# EAGLE design MakePython Lora V1.1 (EAGLE 6.1)
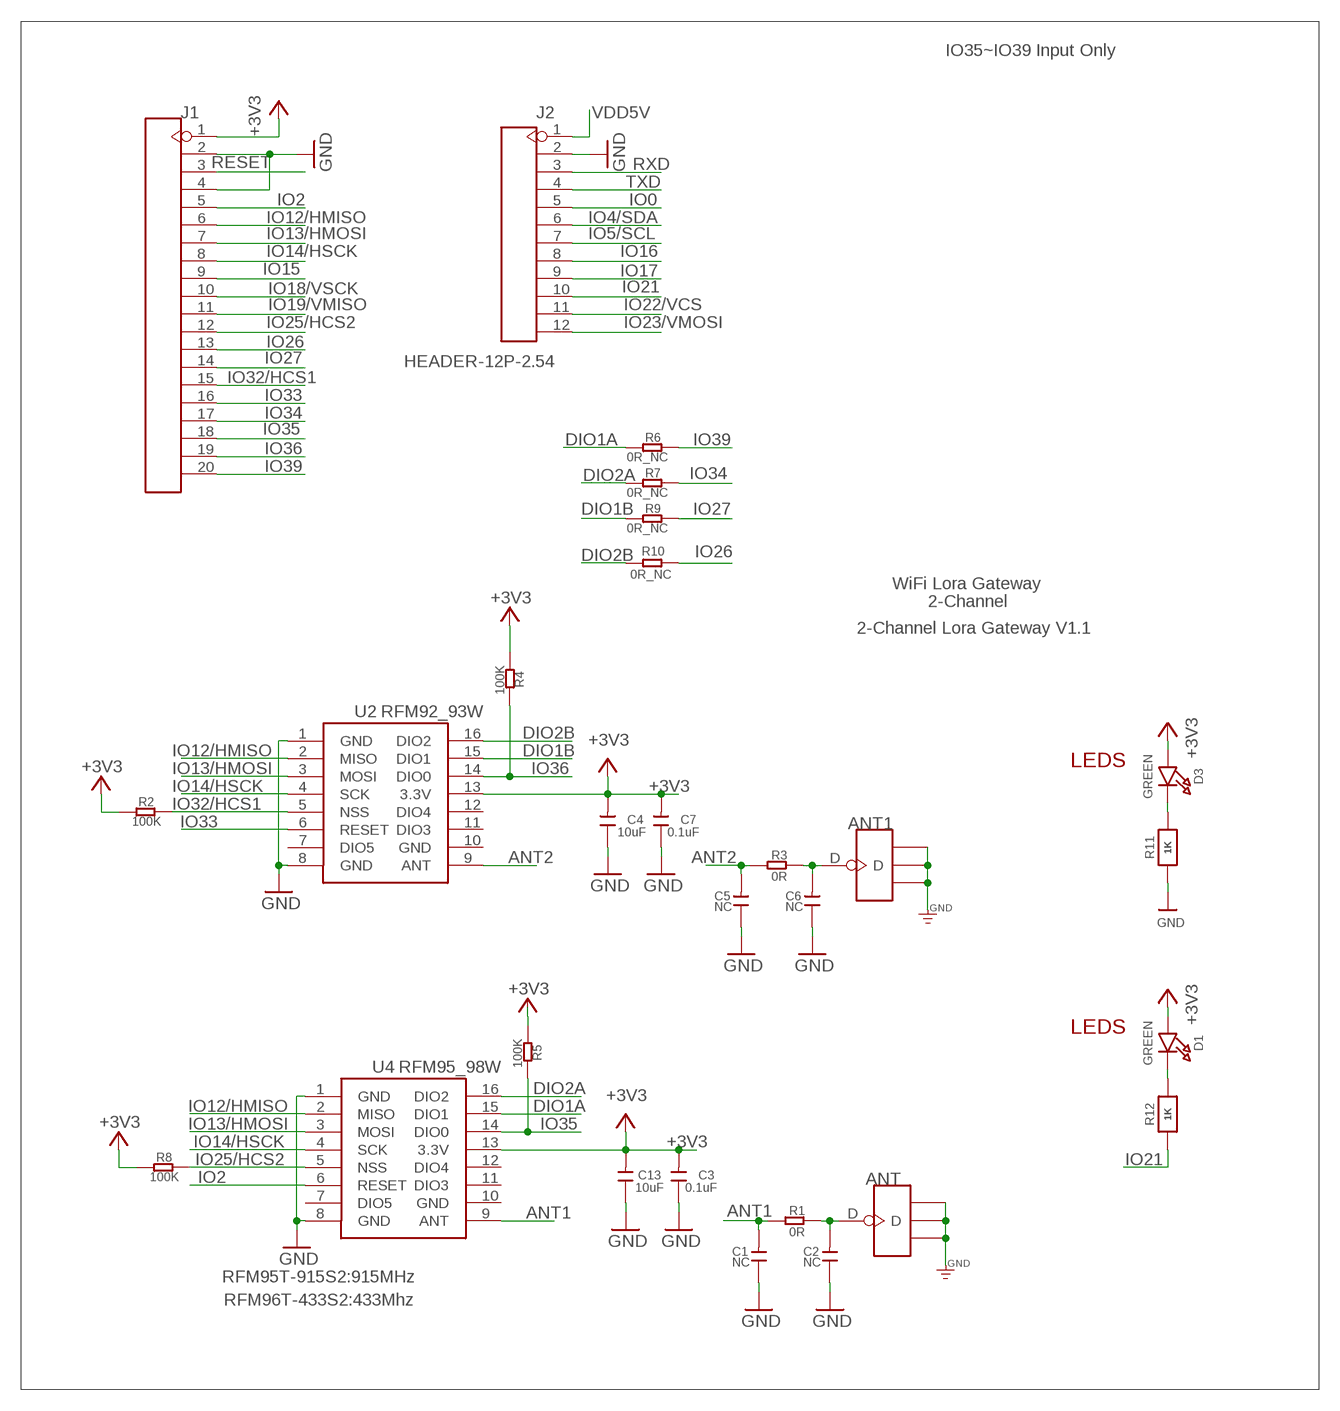
[diagram p0: schematic, sheet 1]

## Parts
ANT  ANTENNA-U-FL  [4P-U-FL]
ANT1  ANTENNA-U-FL  [4P-U-FL]
C1  NC  DISCRETE_C-0603  [DISCRETE_C0603]
C2  NC  DISCRETE_C-0603  [DISCRETE_C0603]
C3  0.1uF  C-0603  [0603]
C4  10uF  C-0603  [0603]
C5  NC  DISCRETE_C-0603  [DISCRETE_C0603]
C6  NC  DISCRETE_C-0603  [DISCRETE_C0603]
C7  0.1uF  C-0603  [0603]
C13  10uF  C-0603  [0603]
D1  GREEN  LED0805_NOOUTLINE  [CHIPLED_0805_NOOUTLINE]
D3  GREEN  LED0805_NOOUTLINE  [CHIPLED_0805_NOOUTLINE]
J1  HEADER-20P-2.54  [20P-2.54]
J2  HEADER-12P-2.54  [12P-2.54]
R1  0R  DISCRETE_R-0603  [DISCRETE_R0603]
R2  100K  R-0603  [R0603]
R3  0R  DISCRETE_R-0603  [DISCRETE_R0603]
R4  100K  R-0603  [R0603]
R5  100K  R-0603  [R0603]
R6  0R_NC  R-0603  [R0603]
R7  0R_NC  R-0603  [R0603]
R8  100K  R-0603  [R0603]
R9  0R_NC  R-0603  [R0603]
R10  0R_NC  R-0603  [R0603]
R11  1K  RESISTOR_0603_NOOUT  [0603-NO]
R12  1K  RESISTOR_0603_NOOUT  [0603-NO]
U2  RFM92_93W  [RFM92_93W]
U4  RFM95_98W  RFM92_93W  [RFM92_93W]

## Nets
+3V3: C3.2 C4.2 C7.2 C13.2 D1.A D3.A J1.1 R2.2 R4.2 R5.2 R8.2 U2.13(3.3V) U4.13(3.3V)
ANT1: C1.2 R1.1 U4.9(ANT)
ANT2: C5.2 R3.1 U2.9(ANT)
DIO1A: R6.2 U4.15(DIO1)
DIO1B: R9.2 U2.15(DIO1)
DIO2A: R7.2 U4.16(DIO2)
DIO2B: R10.2 U2.16(DIO2)
GND: ANT1.GND1 ANT1.GND2 ANT1.GND3 ANT.GND1 ANT.GND2 ANT.GND3 C1.1 C2.1 C3.1 C4.1 C5.1 C6.1 C7.1 C13.1 J1.2 J1.4 J2.2 R11.1 U2.1(GND) U2.8(GND) U4.1(GND) U4.8(GND)
IO0: J2.5
IO2: J1.5 U4.6(RESET)
IO4/SDA: J2.6
IO5/SCL: J2.7
IO12/HMISO: J1.6 U2.2(MISO) U4.2(MISO)
IO13/HMOSI: J1.7 U2.3(MOSI) U4.3(MOSI)
IO14/HSCK: J1.8 U2.4(SCK) U4.4(SCK)
IO15: J1.9
IO16: J2.8
IO17: J2.9
IO18/VSCK: J1.10
IO19/VMISO: J1.11
IO21: J2.10 R12.1
IO22/VCS: J2.11
IO23/VMOSI: J2.12
IO25/HCS2: J1.12 R8.1 U4.5(NSS)
IO26: J1.13 R10.1
IO27: J1.14 R9.1
IO32/HCS1: J1.15 R2.1 U2.5(NSS)
IO33: J1.16 U2.6(RESET)
IO34: J1.17 R7.1
IO35: J1.18 R5.1 U4.14(DIO0)
IO36: J1.19 R4.1 U2.14(DIO0)
IO39: J1.20 R6.1
N$1: ANT1.D C6.2 R3.2
N$2: ANT.D C2.2 R1.2
N$3: D1.C R12.2
N$5: D3.C R11.2
RESET: J1.3
RXD: J2.3
TXD: J2.4
VDD5V: J2.1
Unconnected: U2.7(DIO5) U2.11(DIO3) U2.12(DIO4) U4.7(DIO5) U4.11(DIO3) U4.12(DIO4)

## Notes on the sheet
- IO35~IO39 Input Only
- WiFi Lora Gateway
- 2-Channel
- 2-Channel Lora Gateway V1.1
- LEDS
- LEDS
- RFM95T-915S2:915MHz
- RFM96T-433S2:433Mhz

## Power pins joined to a net without a drawn wire
GND: U2.10(GND) U4.10(GND)

## Library data of the parts
ANT ANT1 = Connector:ANTENNA-U-FL
C1 C2 C5 C6 = A9G:DISCRETE_C*: Ceramic Capacitors
C3 C4 C7 C13 = Discrete:C*: Ceramic Capacitors
D1 D3 = microbuilder:LED: LED 0603 - 0603 Surface Mount Package 2mA: Green LED - Low Power (3.9mcd, 2ma, 1.7Vf) - Digikey: 475-2709-2-ND Orange LED - Low Power (9.8mcd, 2ma, 1.8Vf) - Digikey: 475-1194-2-ND Red LED - Low Power (5mcd, 2ma, 1.8Vf) - Digikey: 475-1195-2-ND Yellow LED - Low Power (7mcd, 2ma, 1.8Vf) - Digikey: 475-1196-2-ND 5mA: Blue LED - Low Power (17mcd, 5ma, 2.9Vf) - Digikey: LNJ937W8CRACT-ND 0805 - 0805 Surface Mount Package 2mA: Red LED (8.8mcd, 2mA, 1.8Vf, Clear) - Low Power [Digikey: 475-2510-1-ND] Green LED (5mcd, 2mA, 1.8Vf, Clear) - Low Power [Digikey: 475-2730-1-ND] Yellow LED (11.3mcd, 2mA, 1.8Vf, Clear) - Low Power [Digikey: 475-2555-1-ND] 20mA: Red LED (104mcd, 20mA, Diffused) - LS R976 [Digikey: 475-1278-6-ND] Red LED (12mcd, 20mA, 2.0Vf, Clear) - APT2012EC [Digikey: 754-1128-1-ND] Green LED (15mcd, 20mA, 2.2Vf, Clear) - APT2012GC [Digikey: 754-1131-1-ND] Orange LED (160mcd, 20mA, 2.1Vf, Clear) - APT2012SECK [Digikey: 754-1130-1-ND] 1206 - 1206 Surface Mount Package Green LED (26mcd, 20mA, Diffused) - LG N971 [Digikey: 475-1407-6-ND] Red LED (15mcd, 20mA, Diffused) - LH N974 [Digikey: 475-1416-6-ND] Cree - Cree High-Power Surface Mount LEDs XPEBWT-L1-0000-00D50 - White 111lm 350mA 2.9Vf 6200K 110° XTEAWT-00-0000-00000LEE3 - White 114lm 350mA 2.85Vf 5000K 115° Everlight - Everlight 45-21 Series Surface Mount LEDs 45-21/QK2C-B2832AC2CB2/2T - Warm White 2000mcd 20mA 3.25Vf 3050K 120° 45-21/LK2C-B38452C4CB2/2T - Nuetral White 2000mcd 20mA 3.25Vf 4150K 120° 45-21/LK2C-B50634C6CB2/2T - Cold White 2200mcd 20mA 3.25Vf 5650K 120° PLCC2 Reverse Mount LS T77K-J1L2-1-0-2-R18-Z - Red 11.25mcd 2mA 1.8Vf 630nm 120° LO T77K-L1M2-24-Z - Orange 19.6mcd 2mA 1.8Vf 606nm 120° LY T77K-K2M1-26-Z - Yellow 15.7mcd 2mA 1.8Vf 587nm 120°
J1 = Connector:HEADER-20P
J2 = Connector:HEADER-12P
R1 R3 = A9G:DISCRETE_R*
R2 R4-R10 = Discrete:R*
R11 R12 = microbuilder:RESISTOR: Resistors For new designs, use the packages preceded by an '_' character since they are more reliable: The following footprints should be used on most boards: _0402 - Standard footprint for regular board layouts _0603 - Standard footprint for regular board layouts _0805 - Standard footprint for regular board layouts _1206 - Standard footprint for regular board layouts For extremely tight-pitch boards where space is at a premium, the following 'micro-pitch' footprints can be used (smaller pads, no silkscreen outline, etc.): _0402MP - Micro-pitch footprint for very dense/compact boards _0603MP - Micro-pitch footprint for very dense/compact boards _0805MP - Micro-pitch footprint for very dense/compact boards _1206MP - Micro-pitch footprint for very dense/compact boards
U2 U4 = dragino:RFM92_93W

## Net classes
0 default: width 0.203 mm, drill 0.305 mm, clearance 0.152 mm
2 gnd: width 0.305 mm, drill 0.559 mm, clearance 0.254 mm
3 usbvcc: width 0.508 mm, drill 0.61 mm, clearance 0.254 mm

## Board
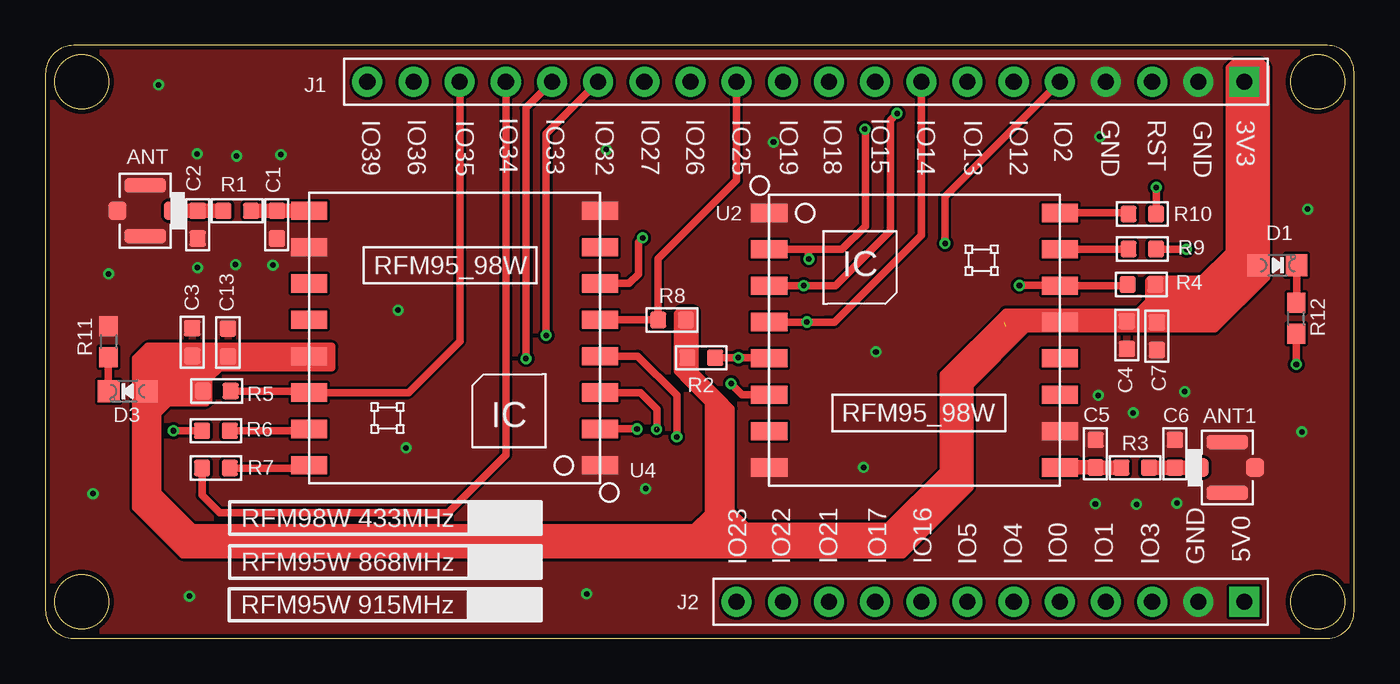
[diagram p1: board, top side]
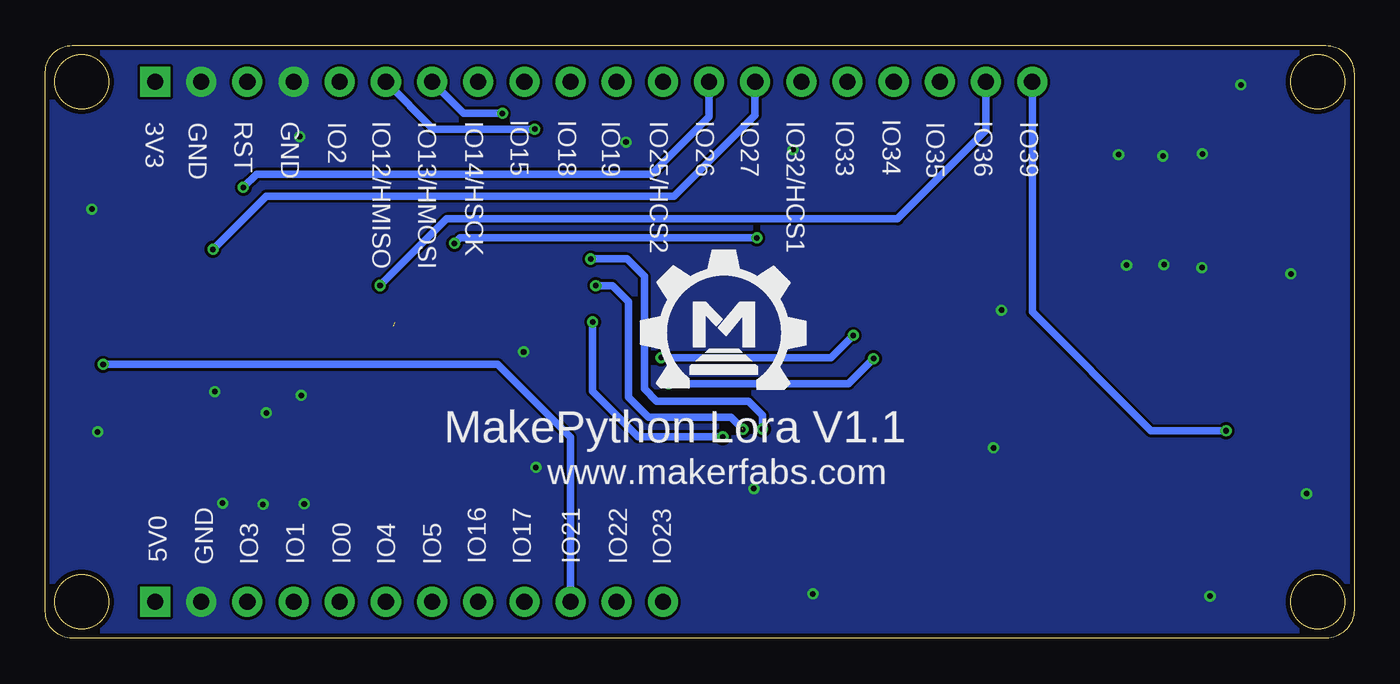
[diagram p2: board, bottom side, seen from below]

Size 72 x 32.6 mm. Coordinates in mm from the lower left corner, seen from the top.
Outline: 1.55,0 70.53,0 arc90 72,1.47 72,31.12 arc90 70.52,32.6 1.55,32.6 arc90 0,31.05 0,1.55 arc90 1.55,0
Outline: circle at 70,2 radius 1.5
Outline: circle at 70,30.6 radius 1.5
Outline: circle at 2,2 radius 1.5
Outline: circle at 2,30.6 radius 1.5
Copper layers (1*16): Top 0.035mm / dielectric 1.5mm / Bottom 0.035mm
Design rules: minimum track width 6mil, minimum drill 12mil, track to track 6mil, track to pad 6mil, pad to pad 6mil, via to via 6mil, smd to smd 0mil, copper to edge 10mil, drill to drill 10mil, minimum pad ring 10mil, minimum via ring 6mil, stop-mask expansion 2mil, vias tented up to drill 100mil, thermal gap 0mil

### Footprints (pad centres in the part's own frame; a part is rotated, then mirrored left to right if it is on the bottom)
4P-U-FL = smd 1.016 x 1.016: D -1.524,0; GND3 1.524,0 | smd 2.286 x 0.762: GND1 0,1.397; GND2 0,-1.397
DISCRETE_C0603 = smd 0.889 x 0.889: 1 -0.762,0; 2 0.762,0
0603 = smd 0.889 x 0.889: 1 -0.762,0; 2 0.762,0
CHIPLED_0805_NOOUTLINE = smd 1.2 x 1.2: A 0,-1.05; C 0,1.05
20P-2.54 = drill 0.889 pad 1.651 square: 1 -25.4,0 | drill 0.889 pad 1.651: 2 -22.86,0; 3 -20.32,0; 4 -17.78,0; 5 -15.24,0; 6 -12.7,0; 7 -10.16,0; 8 -7.62,0; 9 -5.08,0; 10 -2.54,0; 11 0,0; 12 2.54,0; 13 5.08,0; 14 7.62,0; 15 10.16,0; 16 12.7,0; 17 15.24,0; 18 17.78,0; 19 20.32,0; 20 22.86,0
12P-2.54 = drill 0.889 pad 1.651 square: 1 0,13.97 | drill 0.889 pad 1.651: 2 0,11.43; 3 0,8.89; 4 0,6.35; 5 0,3.81; 6 0,1.27; 7 0,-1.27; 8 0,-3.81; 9 0,-6.35; 10 0,-8.89; 11 0,-11.43; 12 0,-13.97
DISCRETE_R0603 = smd 0.889 x 0.889: 1 -0.762,0; 2 0.762,0
R0603 = smd 0.889 x 0.889: 1 -0.762,0; 2 0.762,0
0603-NO = smd 1.1 x 1: 1 -0.85,0; 2 0.85,0
RFM92_93W = smd 2 x 1: 1 -8,7; 2 -8,5; 3 -8,3; 4 -8,1; 5 -8,-1; 6 -8,-3; 7 -8,-5; 8 -8,-7; 9 8,-7; 10 8,-5; 11 8,-3; 12 8,-1; 13 8,1; 14 8,3; 15 8,5; 16 8,7

### Placement (x,y rotation side)
ANT  5.49,23.51 180 top
ANT1  65.03,9.39 0 top
C1  12.73,22.75 90 top
C2  8.37,22.74 90 top
C3  8.08,16.28 270 top
C4  59.5,16.67 90 top
C5  57.77,10.15 270 top
C6  62.14,10.15 270 top
C7  61.15,16.61 90 top
C13  10.04,16.26 270 top
D1  67.79,20.51 270 top
D3  4.54,13.59 90 top
J1  40.57,30.6 180 top
J2  52,2 270 top
R1  10.55,23.5 180 top
R2  36.08,15.43 180 top
R3  59.96,9.38 0 top
R4  60.3,19.45 0 top
R5  9.43,13.6 180 top
R6  9.38,11.41 0 top
R7  9.38,9.36 0 top
R8  34.48,17.5 0 top
R9  60.35,21.4 180 top
R10  60.35,23.33 180 top
R11  3.47,16.31 270 top
R12  68.82,17.59 90 top
U2  47.81,16.39 0 top
U4  22.51,16.51 180 top
U$1  [MAKERFABS_0.3]  38.79,13.73 0 bottom

### Tracks (layer width: path | path; a pad name or v marks a point on that pad's centre or on a via)
+3V3  (1 unrouted)
  Top 0.406: U4.13 C13.2 8.08,15.5 C3.2 8.15,15.52 8.15,13.59 | 8.15,13.59 D3.A 5.08,13.08 5.08,7.62 7.62,5.08 35.56,5.08 | 8.15,13.59 8.67,13.59 R5.2 | R8.2 35.32,17.5 R2.2 35.32,14.21 36.83,12.7 36.83,6.35 35.56,5.08 | J1.1 65.99,30.58 65.99,21.69 63.75,19.45 R4.2 61.06,17.46 C7.2 61.09,17.44 C4.2 59.45,17.39 U2.13 52.77,17.39 50.14,14.76 50.14,8.48 46.43,4.78 35.87,4.78 35.56,5.08 | 15.52,16.05 5.64,16.05 4.98,15.39 4.98,7.16 7.54,4.6 47.17,4.6 50.85,8.28 50.85,13.89 53.98,17.02 64.34,17.02 67.16,19.84 67.16,31.39 66.9,31.65 65.41,31.65 65.13,31.37 65.13,21.26 63.6,19.74 60.78,19.74 60.71,19.66 60.71,18.54 60.1,17.93 52.83,17.93 49.4,14.5 49.4,9.22 46.33,6.15 38.58,6.15 37.72,7.01 37.72,12.62 35.74,14.61 35.74,17.93 35.66,18.01 34.92,18.01 34.77,17.86 34.77,14.68 36.47,12.98 36.47,6.88 35.66,6.07 | 35.28,5.69 35.66,6.07 | 35.66,6.07 8.13,6.07 6.17,8.03 6.17,12.34 6.78,12.95 8.84,12.95 8.99,13.11 8.99,14.28 9.6,14.88 15.75,14.88 15.75,16.05 15.52,16.05 | 15.52,16.05 15.52,15.21 13.41,15.21 13.41,15.75 13.18,15.75 13.18,15.21 | D1.A 66.6,20.51 66.6,22.2
  Top 1.016: 13.18,15.21 13.13,15.21 13.13,15.57 5.64,15.57 5.64,13.87 6.55,13.87 6.55,14.81 9.02,14.81 9.02,15.06 8.41,15.06 8.41,13.49 6.5,13.49 6.5,13.36 7.47,13.36 7.47,14.1 6.07,14.1 6.07,12.9 5.66,12.9 5.66,7.7 7.98,5.38 35.56,5.38 36.55,6.38 36.55,5.51 36.32,5.28 8.08,5.28 7.9,5.11 36.93,5.11 37.47,5.64 37.19,5.92 37.19,12.72 35.15,14.76 35.15,17.12 35.31,17.27 35.31,14.58 37.26,12.62 37.26,5.87 37.97,5.16 37.97,6.1 37.82,6.25 37.82,6.12 38.56,5.38 38.68,5.38 38.76,5.46 46.38,5.46 49.66,8.74 50.37,8.74 50.42,8.69 50.37,8.69 46.89,5.21 46.89,5.44 50.37,8.91 50.37,14.05 53.47,17.14 52.83,17.14 49.96,14.28 49.96,9.12 50.04,9.04 50.04,14.38 53.11,17.45 60.25,17.45 60.81,18.01 61.37,18.01 61.7,17.68 64.16,17.68 66.6,20.12 66.6,22.2 66.6,31.09 66.52,31.17 65.76,31.17 65.68,31.09 65.68,20.45 65.66,20.42 65.56,20.42 63.86,18.72 63.86,18.54 61.82,18.54 61.57,18.8 63.6,18.8 63.8,19
ANT1
  Top 0.406: U4.9 | C1.2
  Top 0.8: R1.1 C1.2 | U4.9 C1.2
ANT2
  Top 0.406: C5.2 | R3.1
  Top 0.8: U2.9 C5.2 | C5.2 R3.1
DIO1A
  Top 0.406: R6.2 14.51,11.41 U4.15
DIO1B
  Top 0.406: U2.15 59.57,21.39 R9.2
DIO2A
  Top 0.406: R7.2 14.51,9.36 U4.16
DIO2B
  Top 0.406: U2.16 59.53,23.39 R10.2
GND  (via drill 0.3)
  other vias: 3.48,20.04 6.22,30.43 12.95,26.59 30.86,26.87 40.06,27.28 58.01,27.58 69.44,23.6 69.13,11.35 62.68,13.56 62.25,7.43 57.77,7.39 45.01,9.4 45.69,15.75 33.02,8.23 19.84,10.46 19.4,18.05 10.46,20.54 2.62,7.95 7.92,2.32 29.78,2.44 60.03,7.36 57.92,13.35 59.85,12.39 8.34,26.64 10.52,26.52 12.51,20.52 8.37,20.38
  pour Bottom: -7.62,34.29 76.2,34.29 76.2,-5.08 -7.62,-5.08
  pour Top: -7.62,34.29 76.2,34.29 76.2,-5.08 -7.62,-5.08
IO2  (via drill 0.3)
  Top 0.406: U4.6 32.11,19.51 32.62,20.02 32.62,21.77 v32.86,22.02 | v49.49,21.71 49.49,24.28 J1.5
  Bottom 0.406: v32.86,22.02 49.19,22.02 v49.49,21.71
IO12/HMISO  (via drill 0.3)
  Top 0.406: U2.2 41.96,21.39 | 41.96,21.39 43.84,21.39 45.11,22.66 45.11,27.97 v45.08,28 | U4.2 v32.55,11.51 | v42,20.86 41.98,20.87 41.98,21.33 41.96,21.36 41.96,21.39
  Bottom 0.406: v45.08,28 50.67,28 J1.6 | v32.55,11.51 32.55,12.26 33.33,13.04 38.37,13.04 39.05,13.71 39.05,19.9 40,20.86 v42,20.86
IO13/HMOSI  (via drill 0.3)  (1 unrouted)
  Top 0.406: v46.86,28.86 46.49,28.49 46.49,22.39 43.48,19.39 v41.72,19.39 U2.3 | U4.3 32.73,13.51 33.65,12.6 33.65,11.55
  Bottom 0.406: v46.86,28.86 48.99,28.86 J1.7 | v41.72,19.39 40.81,19.39 39.93,18.5 39.93,13.26 38.81,12.14 34.29,12.14 v33.63,11.48
IO14/HSCK  (via drill 0.3)
  Top 0.406: U2.4 v41.9,17.39 42.93,17.39 43.42,17.39 48.2,22.17 J1.8 | U4.4 32.58,15.51 34.74,13.35 v34.74,11.08
  Bottom 0.406: v34.74,11.08 39.39,11.08 41.91,13.59 41.91,17.38 v41.9,17.39
IO21  (via drill 0.3)
  Top 0.406: v68.82,15.06 R12.1 | R12.1
  Bottom 0.406: J2.10 43.11,11.05 47.12,15.06 v68.82,15.06
IO25/HCS2
  Top 0.406: U4.5 R8.1 33.71,20.86 38.03,25.18 J1.12
IO26  (via drill 0.3)
  Top 0.406: v61.11,24.79 R10.1
  Bottom 0.406: J1.13 35.49,28.68 38.66,25.51 60.39,25.51 v61.11,24.79
IO27  (via drill 0.3)
  Top 0.406: v62.77,21.39 61.12,21.39 R9.1
  Bottom 0.406: J1.14 32.95,28.76 37.4,24.31 59.85,24.31 v62.77,21.39
IO32/HCS1  (via drill 0.3)
  Top 0.406: U2.5 39.81,15.43 v38.13,15.43 R2.1 | J1.15 27.55,27.74 v27.55,16.66
  Bottom 0.406: v27.55,16.66 28.78,15.43 v38.13,15.43
IO33  (via drill 0.3)
  Top 0.406: J1.16 26.44,29.17 v26.44,15.37 | v37.73,14 38.34,13.39 U2.6
  Bottom 0.406: v26.44,15.37 27.82,14 v37.73,14
IO34
  Top 0.406: R7.1 8.62,7.86 9.57,6.91 22.16,6.91 25.34,10.09 J1.17
IO35
  Top 0.406: R5.1 14.51,13.6 U4.14 19.98,13.51 22.8,16.34 22.8,30.59 J1.18
IO36  (via drill 0.3)
  Top 0.406: R4.1 59.48,19.39 U2.14 v53.59,19.4
  Bottom 0.406: J1.19 20.25,27.93 25.12,23.06 49.93,23.06 v53.59,19.4
IO39  (via drill 0.3)
  Top 0.406: v7.04,11.41 R6.1
  Bottom 0.406: v7.04,11.41 | J1.20 17.71,17.94 11.18,11.41 v7.04,11.41 | v7.04,11.41
N$1
  Top 0.406: ANT1.D | C6.2
  Top 0.8: R3.2 C6.2 ANT1.D
N$2
  Top 0.406: C2.2 | R1.2
  Top 0.8: ANT.D C2.2 | C2.2 R1.2
N$3
  Top 0.406: R12.2 68.84,18.44 D1.C
N$5
  Top 0.406: D3.C 3.47,13.59 R11.2

### Text on the board
tPlace: IO39 | IO36 | IO34 | IO33 | IO32 | IO27 | IO26 | IO25 | IO19 | IO18 | IO15 | IO14 | IO13 | IO12 | GND | RST | IO35 | IO2 | GND | 3V3 | RFM98W 433MHz | RFM95W 868MHz | IO23 | IO22 | IO21 | IO17 | IO16 | IO5 | IO4 | IO0 | IO1 | IO3 | GND | 5V0 | RFM95W 915MHz
bPlace: IO34 | IO33 | IO18 | IO15 | IO39 | IO36 | IO35 | IO32/HCS1 | IO27 | IO26 | IO25/HCS2 | IO19 | IO14/HSCK | IO13/HMOSI | IO12/HMISO | IO2 | GND | RST | GND | 3V3 | MakePython Lora V1.1 | www.makerfabs.com | IO23 | IO22 | IO21 | IO17 | IO16 | IO5 | IO4 | IO0 | IO1 | IO3 | GND | 5V0
tNames: U2 | U4